# EasyEDA Pro project xu316-hardware-20260830.epro

# Schematic Schematic1

## Sheets
1 XMOS
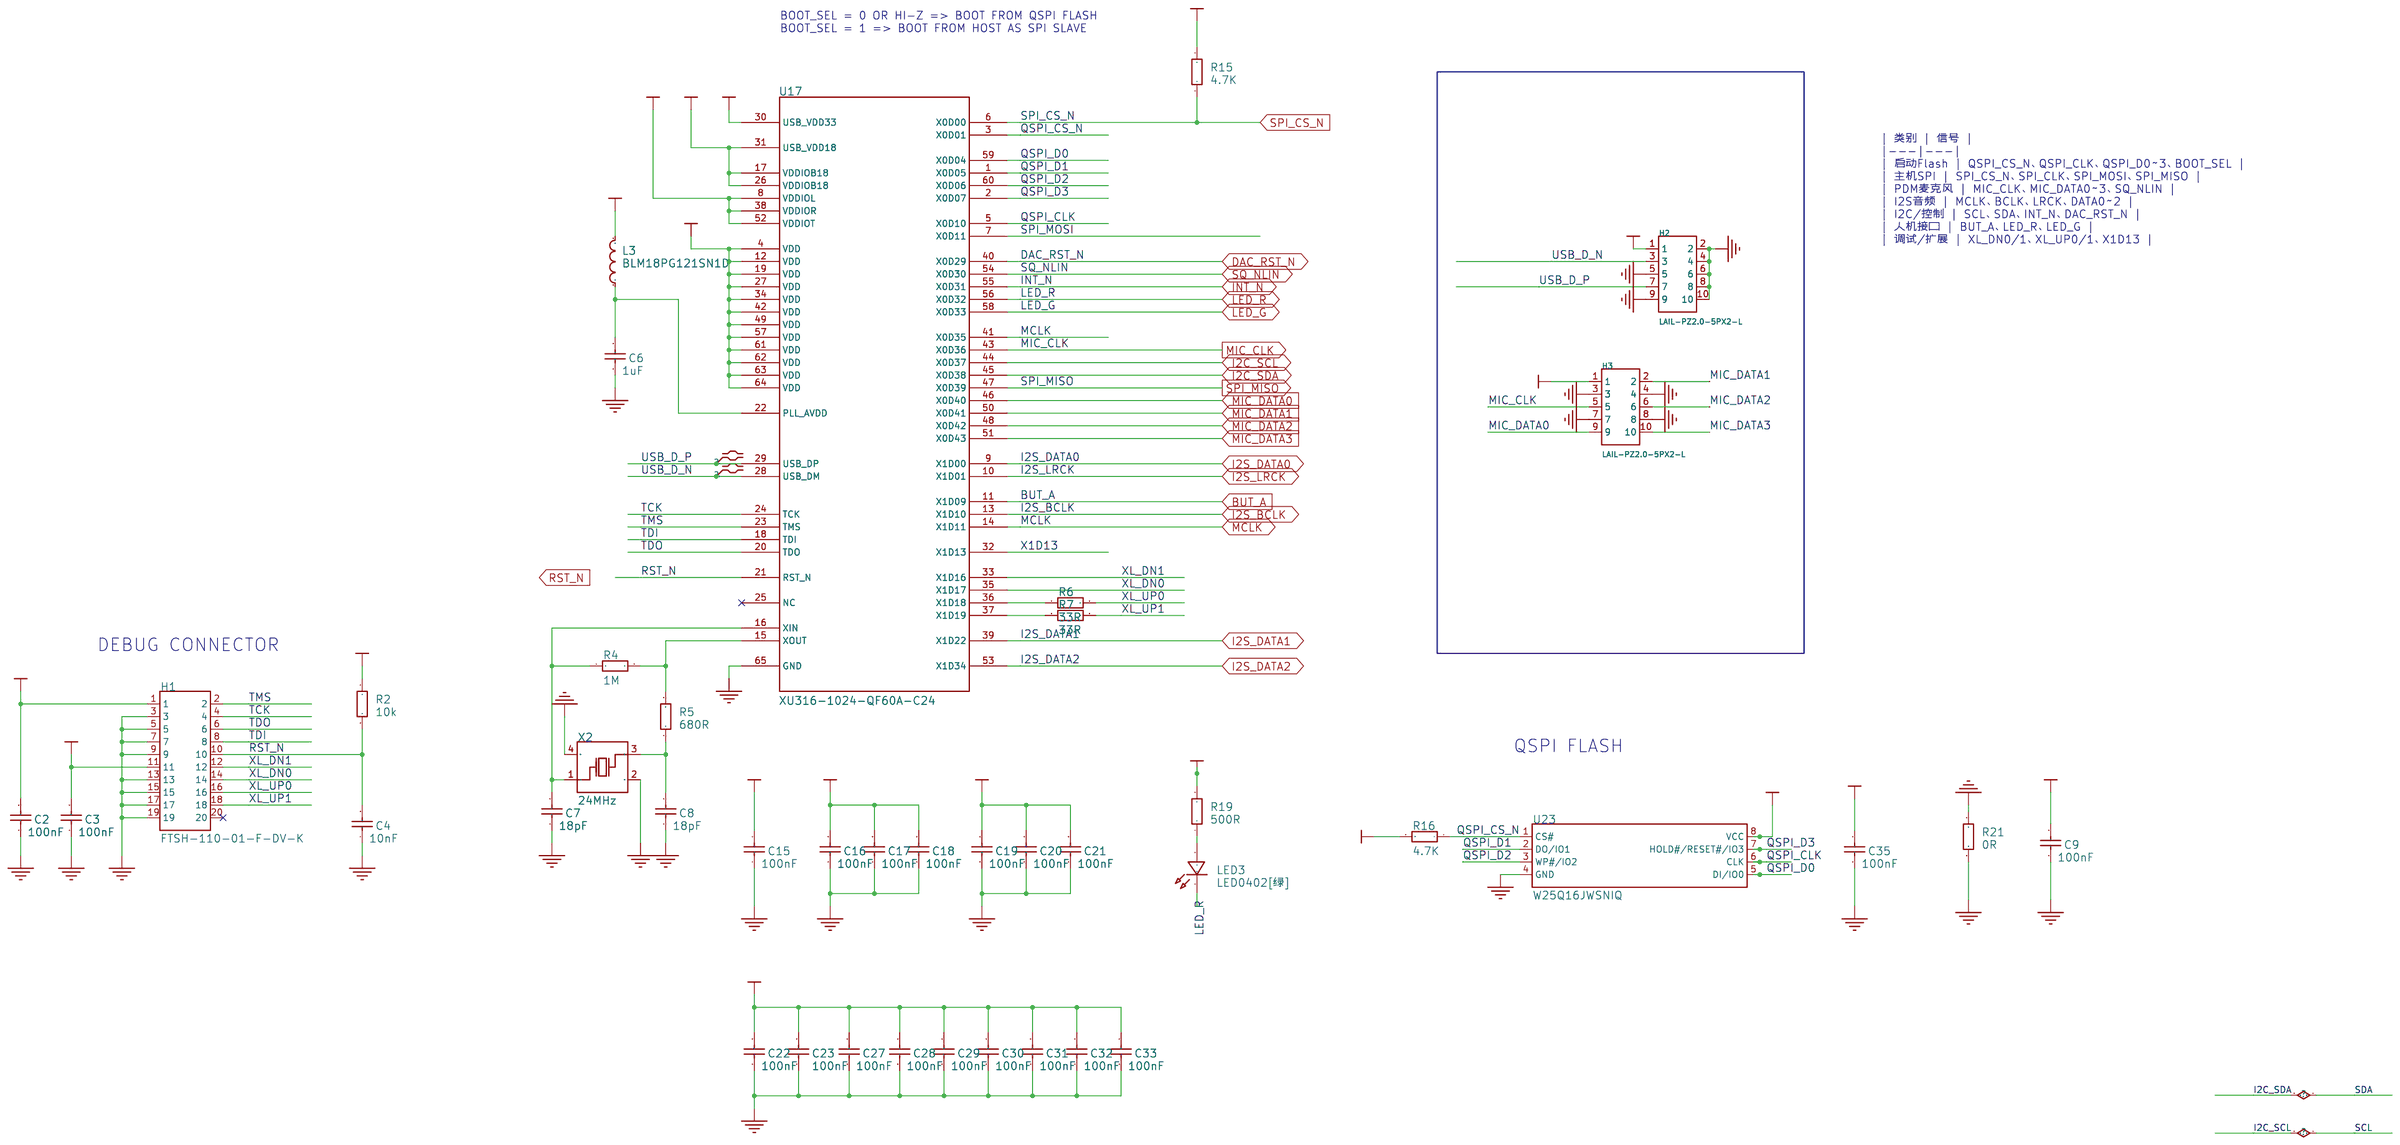
[diagram p0: XMOS]
2 Power
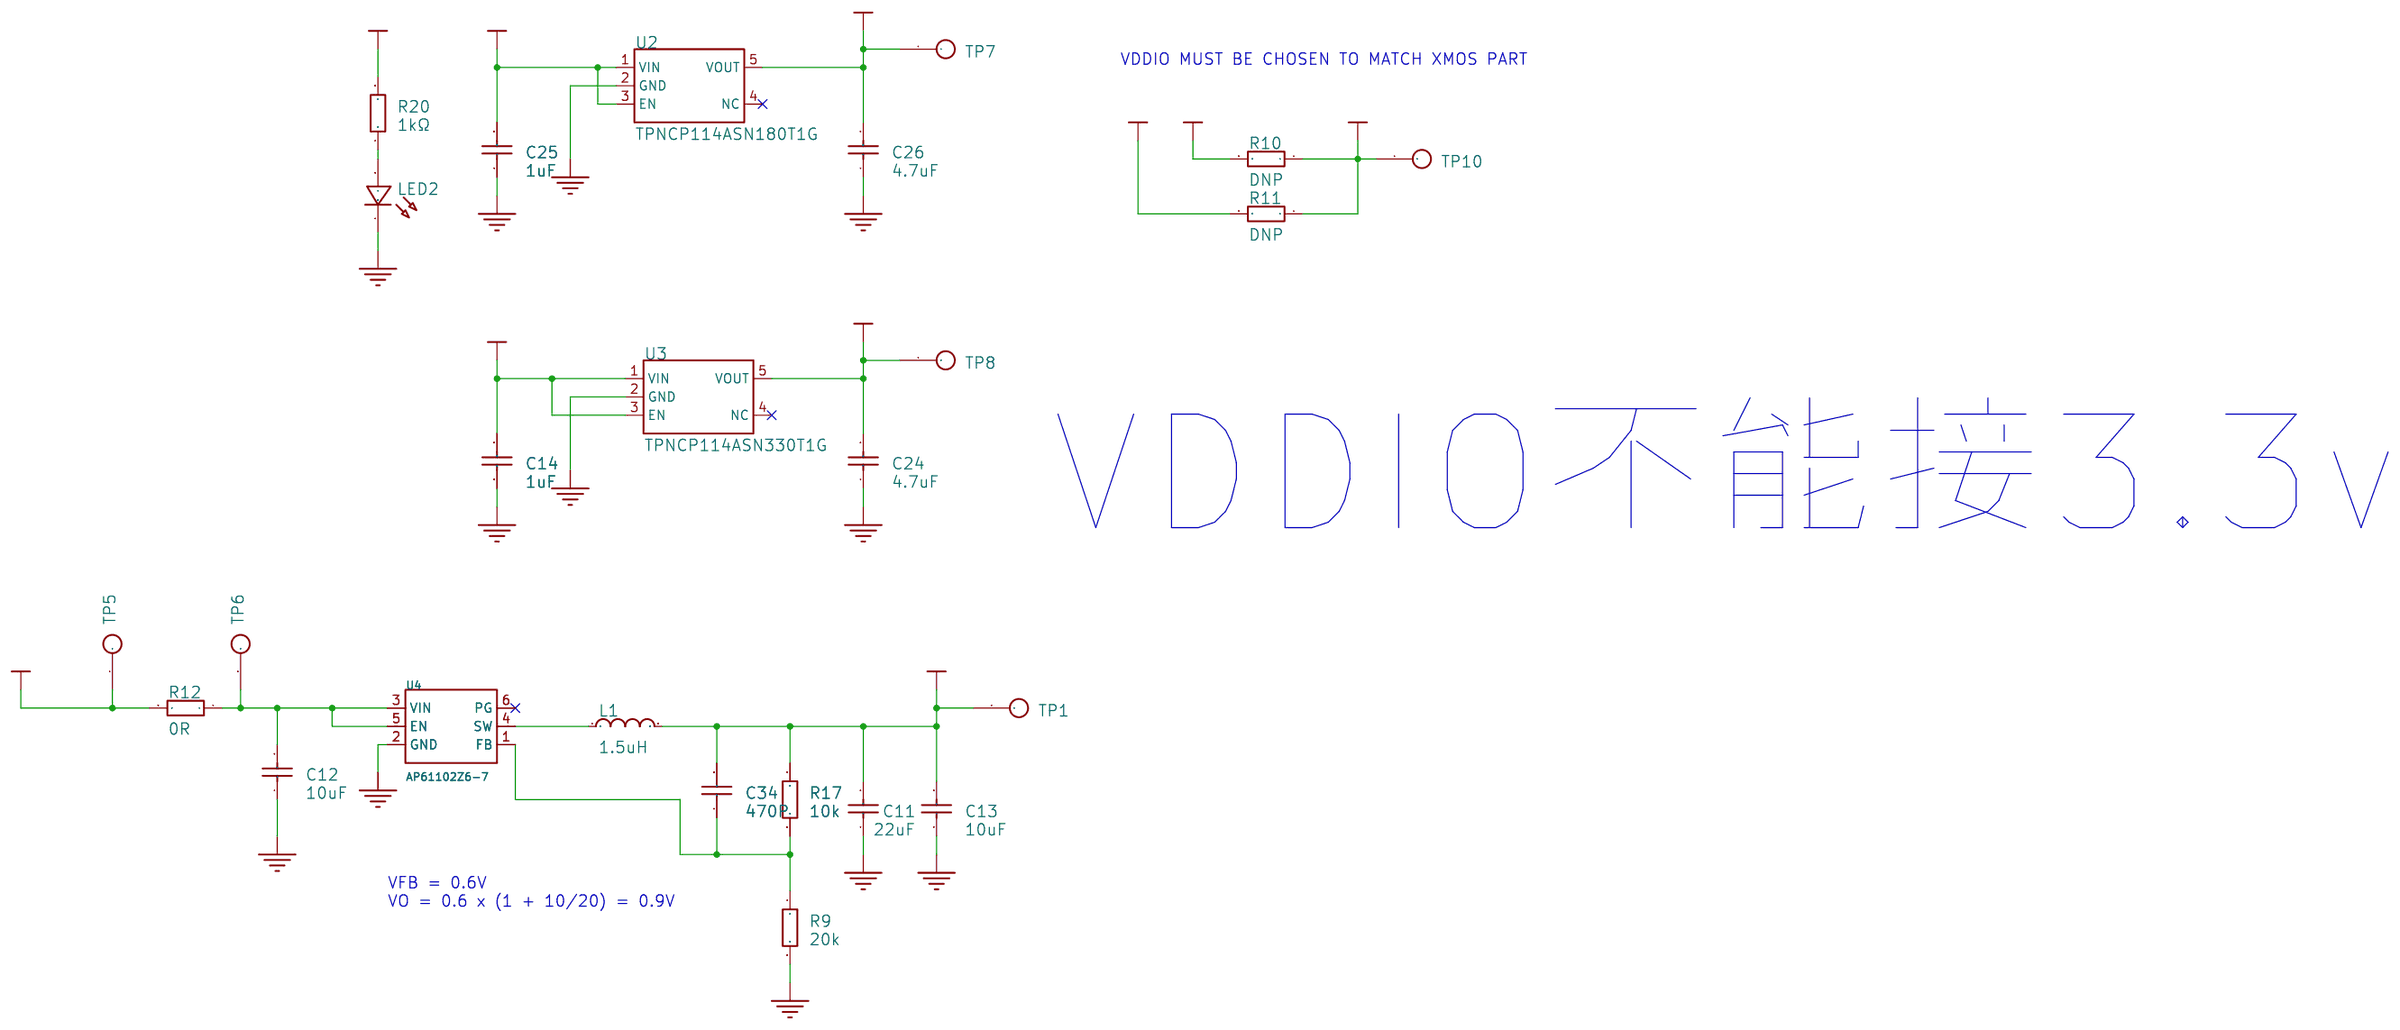
[diagram p1: Power]

## Parts
sheet Power
C11  22uF  [C0402]
C12  10uF  [C0402]
C13  10uF  [C0402]
C14  1uF  [C0402]
C24  4.7uF  [C0402]
C25  1uF  [C0402]
C26  4.7uF  [C0402]
C34  470P  [C0402]
L1  1.5uH  [IND-SMD_L4.0-W4.0_PRS4018]
LED2  -  [LED_0603]
R9  20k  [R0402]
R10  DNP  [R0402]
R11  DNP  [R0402]
R12  0R  [R0402]
R17  10k  [R0402]
R20  1kΩ  [R0402]
TP1  TESTPOINT  [TESTPOINT_SMD_0.9MM_L]
TP5  TESTPOINT  [TESTPOINT_THRU]
TP6  TESTPOINT  [TESTPOINT_THRU]
TP7  TESTPOINT  [TESTPOINT_SMD_0.9MM_L]
TP8  TESTPOINT  [TESTPOINT_SMD_0.9MM_L]
TP10  TESTPOINT  [TESTPOINT_SMD_0.9MM_L]
U2  TPNCP114ASN180T1G  [SOT-23-5_L2.9-W1.6-P0.95-LS2.8-BR]
U3  TPNCP114ASN330T1G  [SOT-23-5_L2.9-W1.6-P0.95-LS2.8-BR]
U4  AP61102Z6-7  [SOT-563-6_L1.6-W1.2-P0.50-LS1.6-BL]
sheet XMOS
?#1  DIFFPAIR
?#2  DIFFPAIR
C2  100nF  [C0402]
C3  100nF  [C0402]
C4  10nF  [C0402]
C6  1uF  [C0402]
C7  18pF  [C0402]
C8  18pF  [C0402]
C9  100nF  [C0402]
C15  100nF  [C0402]
C16  100nF  [C0402]
C17  100nF  [C0402]
C18  100nF  [C0402]
C19  100nF  [C0402]
C20  100nF  [C0402]
C21  100nF  [C0402]
C22  100nF  [C0402]
C23  100nF  [C0402]
C27  100nF  [C0402]
C28  100nF  [C0402]
C29  100nF  [C0402]
C30  100nF  [C0402]
C31  100nF  [C0402]
C32  100nF  [C0402]
C33  100nF  [C0402]
C35  100nF  [C0402]
H1  FTSH-110-01-F-DV-K  [CONN-SMD_20P-P1.27_FTSH-110-01-F-DV-K-P-TR]
H2  LAIL-PZ2.0-5PX2-L  [HDR-TH_LAIL-PZ2.0-5PX2-L]
H3  LAIL-PZ2.0-5PX2-L  [HDR-TH_LAIL-PZ2.0-5PX2-L]
L3  BLM18PG121SN1D  [L0603]
LED3  LED0402[绿]  [LED0402-R-RD_GREEN]
R2  10k  [R0402]
R4  1M  [R0402]
R5  680R  [R0402]
R6  33R  [R0402]
R7  33R  [R0402]
R15  4.7K  [R0402]
R16  4.7K  [R0402]
R19  500R  [R0402]
R21  0R  [R0402]
U17  XU316-1024-QF60A-C24  [QFN-60_L7.0-W7.0-P0.40-TL-EP3.6]
U23  W25Q16JWSNIQ  [SOP-8_L4.9-W3.9-P1.27-LS6.0-BL]
X2  24MHz  [OSC-SMD_4P-XRCGB24M000F0L00R0]

## Library data of the parts
C2-C4 C6-C9 C11-C35 = CL05A106MQ5NUNC: 容值:10uF;精度:±20%;额定电压:6.3V;温度系数:X5R;; LCSC Part Name: 10uF ±20% 6.3V; Supplier Part: C15525; Manufacturer: SAMSUNG(三星); Supplier Footprint: 0402; JLCPCB Part Class: Basic Part; Datasheet: https://item.szlcsc.com/datasheet/CL05A106MQ5NUNC/16204.html; Supplier: LCSC; Tolerance: ±20%; Voltage Rating: 6.3V; Temperature Coefficient: X5R
L1 = PSPNAQ4020-1R5M: 电感值:1.5uH;精度:±20%;额定电流:1.98A;饱和电流(Isat):4.45A;; LCSC Part Name: 1.5uH ±20% 4.45A; Supplier Part: C436656; Manufacturer: PROD(谱罗德); Supplier Footprint: SMD,4x4mm; JLCPCB Part Class: Extended Part; Datasheet: https://item.szlcsc.com/datasheet/PSPNAQ4020-1R5M/434435.html; Supplier: LCSC; Tolerance: ±20%; Current Rating: 1.98A; Current - Saturation(Isat): 4.45A; DC Resistance(DCR): 35mΩ; Ratings: AEC-Q200
LED2 = LED_0603-R: Supplier Footprint: 0603; Supplier Part: C84263
R2 R4-R7 R9-R12 R15-R17 R19-R21 = 0402WGF1001TCE: 电阻类型:厚膜电阻;阻值:1kΩ;精度:±1%;功率:62.5mW;最大工作电压:50V;温度系数:±100ppm/℃;; LCSC Part Name: 1kΩ ±1% 62.5mW 厚膜电阻; Supplier Part: C11702; Manufacturer: UNI-ROYAL(厚声); Supplier Footprint: 0402; JLCPCB Part Class: 基础库; Datasheet: https://atta.szlcsc.com/upload/public/pdf/source/20200306/C422600_1E6D84923E4A46A82E41ADD87F860B5C.pdf; Supplier: LCSC; Type: 厚膜电阻; Tolerance: ±1%; Power(Watts): 62.5mW; Overload Voltage (Max): 50V; Temperature Coefficient: ±100ppm/℃; Operating Temperature Range: -55℃~+155℃
TP1 TP7 TP8 TP10 = GEN-24-0019: Testpoint, SMD, 0.9mm; Manufacturer: NA; Manufacturer Part Number: NA; Approx Volume Cost ($): NA; LibraryName: JG_GeneralLibrary
TP5 TP6 = GEN-24-0002: Testpoint, Through Hole; Manufacturer: NA; Manufacturer Part Number: NA; Approx Volume Cost ($): NA; LibraryName: JG_GeneralLibrary
U2 = TPNCP114ASN180T1G: 输出极性:正极;工作电压:5.5V;输出电压:1.8V;输出电流:300mA;电源纹波抑制比(PSRR):-;输出类型:固定;; LCSC Part Name: 1.8V 300mA 5.5V; Supplier Part: C5350816; Manufacturer: TECH PUBLIC(台舟); Supplier Footprint: SOT-23-5; JLCPCB Part Class: Extended Part; Datasheet: https://item.szlcsc.com/datasheet/TPNCP114ASN180T1G/6138666.html; Supplier: LCSC; Output Configuration: 正极; Voltage - Supply: 5.5V; Output Voltage: 1.8V; Output Current: 300mA; Voltage Dropout: 280mV@(300mA); standby current: 25uA; Features: 过流保护；使能控制；热关断；输出放电; Operating Temperature: -40℃~+85℃@(Ta); Output Type: 固定; Number of Outputs: 1
U3 = TPNCP114ASN330T1G: 输出极性:正极;工作电压:5.5V;输出电压:3.3V;输出电流:300mA;电源纹波抑制比(PSRR):-;输出类型:固定;; LCSC Part Name: 3.3V 300mA 5.5V; Supplier Part: C5350815; Manufacturer: TECH PUBLIC(台舟); Supplier Footprint: SOT-23-5; JLCPCB Part Class: Extended Part; Datasheet: https://item.szlcsc.com/datasheet/TPNCP114ASN330T1G/6138665.html; Supplier: LCSC; Output Configuration: 正极; Voltage - Supply: 5.5V; Output Voltage: 3.3V; Output Current: 300mA; Voltage Dropout: 180mV@(300mA); standby current: 25uA; Features: 使能控制；过流保护；输出放电；热关断; Operating Temperature: -40℃~+85℃@(Ta); Output Type: 固定; Number of Outputs: 1
U4 = AP61102Z6-7_C3193199: 功能类型:降压型;工作电压:2.3V~5.5V;输出电压:600mV~3.6V;输出电流:1A;输出类型:可调;; LCSC Part Name: 降压型 1A 2.3V~5.5V; Supplier Part: C3193199; Manufacturer: DIODES(美台); Supplier Footprint: SOT-563; JLCPCB Part Class: Extended Part; Datasheet: https://item.szlcsc.com/datasheet/AP61102Z6-7/3755146.html; Supplier: LCSC; Function: 降压型; Voltage - Supply: 2.3V~5.5V; Output Voltage: 600mV~3.6V; Output Current: 1A; Frequency - Switching: 2.2MHz; Operating Temperature: -40℃~+85℃; Synchronous Rectifier: 是; Number of Outputs: 1; Topology: 降压式; Quiescent Current: 15uA; Switch tube (built-in/external): 内置; Output Type: 可调; Features: 轻载高效模式；逐波限流；过流保护；输出放电；工作状态指示；打嗝限流
?#1 ?#2 = DIFFPAIR: DifferentialPair: True; DifferentialPairClassName: USB
H1 = FTSH-110-01-F-DV-K: 插针结构:2x10P;间距:1.27mm;行距:1.27mm;圆针/方针:方针;安装方式:立贴;排数:双排;总PIN位数:20P;额定电流:3.4A;配合针长度:3.05mm;端接针长度:-;触头材质:磷青铜;触头镀层:金;工作温度:-55℃~+125℃;颜色:黑色;; LCSC Part Name: 2x10P 间距:1.27mm 方针 立贴; Supplier Part: C22143739; Manufacturer: SAMTEC; Supplier Footprint: SMD,P=1.27mm; JLCPCB Part Class: Extended Part; Datasheet: https://item.szlcsc.com/datasheet/FTSH-110-01-F-DV-K/23575155.html; Supplier: LCSC; Pin Structure: 2x10P; Pitch: 1.27mm; Row Spacing: 1.27mm; Circluar Pins/Square Pins: 方针; Mounting Type: 立贴; Number of Rows: 双排; Number of Pins: 20P; Current Rating: 3.4A; Length of Mating Pin: 3.05mm; Contact Material: 磷青铜; Contact Plating: 金; Operating Temperature: -55℃~+125℃; Color: 黑色
H2 H3 = LAIL-PZ2.0-5PX2-L: 插针结构:2x5P;间距:2mm;行距:2mm;圆针/方针:方针;排数:双排;总PIN位数:10P;额定电流:2A;额定电压:250V;塑高:2mm;端接针长度:2.8mm;触头材质:黄铜;触头镀层:金;工作温度:-25℃~+80℃;颜色:黑色;; LCSC Part Name: 2x5P 间距:2mm 方针; Supplier Part: C54950581; Manufacturer: 莱联; Supplier Footprint: 插件,P=2mm; JLCPCB Part Class: Extended Part; Datasheet: https://item.szlcsc.com/datasheet/LAIL-PZ2.0-5PX2-L/58519934.html; Supplier: LCSC; Pin Structure: 2x5P; Pitch: 2mm; Row Spacing: 2mm; Circluar Pins/Square Pins: 方针; Number of Rows: 双排; Number of Pins: 10P; Current Rating: 2A; Voltage Rating (Max): 250V; Insulation Height: 2mm; Length of End Connection Pin: 2.8mm; Contact Material: 黄铜; Contact Plating: 金; Operating Temperature: -25℃~+80℃; Color: 黑色
L3 = BLM18PG121SN1D: 阻抗@频率:120Ω@100MHz;误差:±25%;直流电阻(DCR):50mΩ;; LCSC Part Name: 单路 0603磁珠 阻抗120Ω@100MHz; Supplier Part: C14709; Manufacturer: muRata(村田); Supplier Footprint: 0603; JLCPCB Part Class: Basic Part; Datasheet: https://item.szlcsc.com/datasheet/BLM18PG121SN1D/15379.html; Supplier: LCSC; Impedance @ Frequency: 120Ω@100MHz; Tolerance: ±25%; DC Resistance(DCR): 50mΩ; Current Rating: 2A; Number of Circuits: 1; Operating Temperature: -55℃~+125℃
LED3 = LED0402[绿]: Supplier Part: C9900022545; Supplier Footprint: LED0402; JLCPCB Part Class: Extended Part; Supplier: LCSC
U17 = GEN-08-0033: Processor, xcore.ai, 7x7mm 60QFN, 1200MIPS, 1.8V VDDIO; Manufacturer: XMOS; Approx Volume Cost ($): 1; Web Search Link: http://www.google.com/search?q=XU316-1024-QF60A; LibraryName: JG_GeneralLibrary
U23 = W25Q16JWSNIQ: 接口类型:SPI;存储容量:16Mbit;时钟频率(fc):133MHz;; LCSC Part Name: 具备双路、四路SPI接口的1.8V、16Mbit 串行闪存; Supplier Part: C7117004; Manufacturer: Winbond(华邦); Supplier Footprint: SOIC-8; JLCPCB Part Class: Extended Part; Datasheet: https://item.szlcsc.com/datasheet/W25Q16JWSNIQ/8083750.html; Supplier: LCSC; Interface: SPI; Memory Size: 16Mbit; Clock Frequency: 133MHz; Voltage - Supply: 1.65V~1.95V; Standby Supply Current: 5uA; Program / Erase Cycles: 100000次; Page Programming Time (Tpp): 800us; Data Retention - TDR (Year): 20年; Operating Temperature: -40℃~+85℃; Features: 硬件写保护；绝对写保护；写使能锁存；软件写保护；上电复位
X2 = XRCGB24M000F0L00R0: 晶振类型:贴片晶振;频率:24MHz;常温频差:±100ppm;负载电容:6pF;频率稳定度:±50ppm;; LCSC Part Name: 24MHz ±100ppm 6pF; Supplier Part: C127896; Manufacturer: muRata(村田); Supplier Footprint: SMD2016-4P; JLCPCB Part Class: Extended Part; Datasheet: https://item.szlcsc.com/datasheet/XRCGB24M000F0L00R0/139179.html; Supplier: LCSC; Type: 贴片晶振; Normal temperature Frequency Tolerance: ±100ppm; Load Capacitance: 6pF; Frequency Stability: ±50ppm; Equivalent Series Resistance(ESR): 150Ω; Operating Temperature: -30℃~+85℃

## Nets
0V9: C11.2 C13.2 C22.2 C23.2 C27.2 C28.2 C29.2 C30.2 C31.2 C32.2 C33.2 C34.2 L1.2 L3.2 R17.1 TP1.1 U17.4(VDD) U17.12(VDD) U17.19(VDD) U17.27(VDD) U17.34(VDD) U17.42(VDD) U17.49(VDD) U17.57(VDD) U17.61(VDD) U17.62(VDD) U17.63(VDD) U17.64(VDD)
1V8: C2.2 C16.2 C17.2 C18.2 C26.2 H1.1 R2.1 R11.2 TP7.1 U2.5(VOUT) U17.17(VDDIOB18) U17.26(VDDIOB18) U17.31(USB_VDD18)
3V3: C15.2 C24.2 R10.2 TP8.1 U3.5(VOUT) U17.30(USB_VDD33)
5V: C14.2 C25.2 H2.1 R12.2 R20.2 TP5.1 U2.1(VIN) U2.3(EN) U3.1(VIN) U3.3(EN)
GND: C2.1 C3.1 C4.1 C6.1 C7.1 C8.1 C9.1 C11.1 C12.1 C13.1 C14.1 C15.1 C16.1 C17.1 C18.1 C19.1 C20.1 C21.1 C22.1 C23.1 C24.1 C25.1 C26.1 C27.1 C28.1 C29.1 C30.1 C31.1 C32.1 C33.1 C35.1 H1.3 H1.5 H1.7 H1.9 H1.13 H1.15 H1.17 H1.19 H2.2 H2.4 H2.5 H2.6 H2.8 H2.9 H2.10 LED2.1(C) R9.2 R21.2 U2.2(GND) U3.2(GND) U4.2(GND) U17.65(GND) U23.4(GND) X2.2(GND) X2.4(GND)
GND0: H3.3 H3.4 H3.7 H3.8 R21.1
VDDIO: C3.2 C9.2 C19.2 C20.2 C21.2 C35.2 H1.11 H3.1 R10.1 R11.1 R15.2 R16.2 R19.2 TP10.1 U17.8(VDDIOL) U17.38(VDDIOR) U17.52(VDDIOT) U23.8(VCC)
BUT_A: U17.11(X1D09)
DAC_RST_N: U17.40(X0D29)
I2C_SCL: U17.44(X0D37)
I2C_SDA: U17.45(X0D38)
I2S_BCLK: U17.13(X1D10)
I2S_DATA0: U17.9(X1D00)
I2S_DATA1: U17.39(X1D22)
I2S_DATA2: U17.53(X1D34)
I2S_LRCK: U17.10(X1D01)
INT_N: U17.55(X0D31)
LED_G: U17.58(X0D33)
LED_R: LED3.2 U17.56(X0D32)
MCLK: U17.14(X1D11) U17.41(X0D35)
MIC_CLK: H3.5 U17.43(X0D36)
MIC_DATA0: H3.9 U17.46(X0D40)
MIC_DATA1: H3.2 U17.50(X0D41)
MIC_DATA2: H3.6 U17.48(X0D42)
MIC_DATA3: H3.10 U17.51(X0D43)
QSPI_CLK: U17.5(X0D10) U23.6(CLK)
QSPI_CS_N: R16.1 U17.3(X0D01) U23.1(CS#)
QSPI_D0: U17.59(X0D04) U23.5(DI/IO0)
QSPI_D1: U17.1(X0D05) U23.2(DO/IO1)
QSPI_D2: U17.60(X0D06) U23.3(WP#/IO2)
QSPI_D3: U17.2(X0D07) U23.7(HOLD#/RESET#/IO3)
RST_N: C4.2 H1.10 R2.2 U17.21(RST_N)
SPI_CS_N: R15.1 U17.6(X0D00)
SPI_MISO: U17.47(X0D39)
SPI_MOSI: U17.7(X0D11)
SQ_NLIN: U17.54(X0D30)
TCK: H1.4 U17.24(TCK)
TDI: H1.8 U17.18(TDI)
TDO: H1.6 U17.20(TDO)
TMS: H1.2 U17.23(TMS)
USB_D_N: ?#2.0 H2.3 U17.28(USB_DM)
USB_D_P: ?#1.0 H2.7 U17.29(USB_DP)
X1D13: U17.32(X1D13)
XL_DN0: H1.14 U17.35(X1D17)
XL_DN1: H1.12 U17.33(X1D16)
XL_UP0: H1.16 R6.2
XL_UP1: H1.18 R7.2
$1N6: C6.2 L3.1 U17.22(PLL_AVDD)
$1N19: C7.2 R4.1 U17.16(XIN) X2.1(OSC1)
$1N20: R4.2 R5.2 U17.15(XOUT)
$1N110: R6.1 U17.36(X1D18)
$1N111: R7.1 U17.37(X1D19)
$1N173: C8.2 R5.1 X2.3(OSC2)
$1N180: LED3.1 R19.1
$2N13: L1.1 U4.4(SW)
$2N17: C12.2 R12.1 TP6.1 U4.3(VIN) U4.5(EN)
$2N18: C34.1 R9.1 R17.2 U4.1(FB)
$2N40: LED2.2(A) R20.1

Not connected (* = marked no-connect by the designer): H1 20*; U2 4(NC)*; U3 4(NC)*; U4 6(PG)*; U17 25(NC)*

## Notes on the sheets
sheet 1
- BOOT_SEL = 0 OR HI-Z => BOOT FROM QSPI FLASH
- BOOT_SEL = 1 => BOOT FROM HOST AS SPI SLAVE
- | 类别 | 信号 |
  |---|---|
  | 启动Flash | QSPI_CS_N、QSPI_CLK、QSPI_D0～3、BOOT_SEL |
  | 主机SPI | SPI_CS_N、SPI_CLK、SPI_MOSI、SPI_MISO |
  | PDM麦克风 | MIC_CLK、MIC_DATA0～3、SQ_NLIN |
  | I2S音频 | MCLK、BCLK、LRCK、DATA0～2 |
  | I2C/控制 | SCL、SDA、INT_N、DAC_RST_N |
  | 人机接口 | BUT_A、LED_R、LED_G |
  | 调试/扩展 | XL_DN0/1、XL_UP0/1、X1D13 |
- DEBUG CONNECTOR
- QSPI FLASH
sheet 2
- VDDIO MUST BE CHOSEN TO MATCH XMOS PART
- VDDIO不能接3.3v
- VFB = 0.6V
- VO = 0.6 x (1 + 10/20) = 0.9V

# Board PCB1
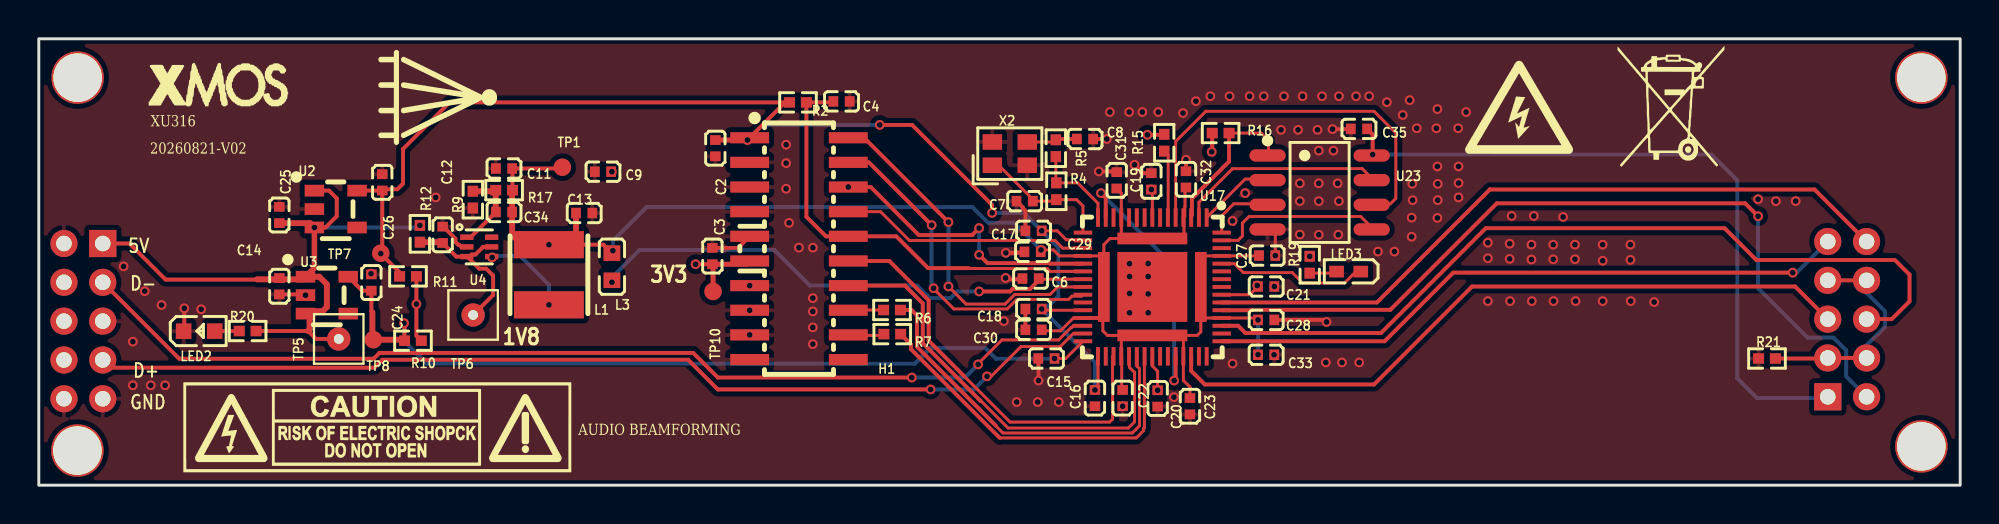
[diagram p2: board, top side]
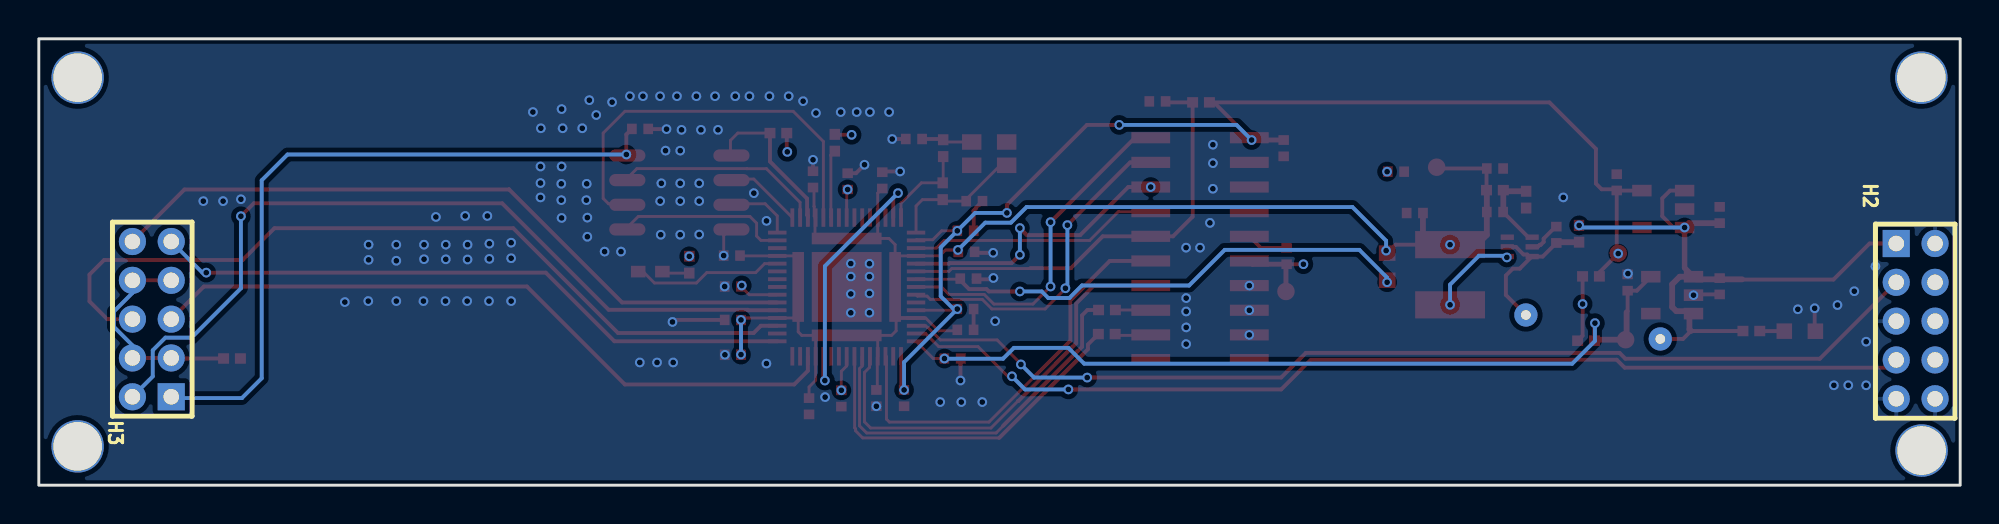
[diagram p3: board, bottom side, seen from below]

Outline 99 x 23 mm; copper layers: Top Layer, VDDIO, GND, Bottom Layer. Coordinates in mm from the lower left corner of the outline.
Outline path: rectangle 0,23 99,0
Stack: Top Layer 0.035mm Outer layer thickness 1oz / Dielectric1 0.2104mm 7628 RC49% 8.6mil / VDDIO 0.0152mm Inner layer thickness / Dielectric2 1.065mm 1.1mm H/HOZ Copper / GND 0.0152mm Inner layer thickness / Dielectric3 0.2104mm 7628 RC49% 8.6mil / Bottom Layer 0.035mm Outer layer thickness 1oz

## Design rules (mm)
net USB_D_P: USB-DP
net USB_D_N: USB-DP
spacing copperThickness1oz (default): track to track 0.102, other pairs 0.152 to 0.3
spacing copperThickness2oz: track to track 0.203, other pairs 0.152 to 0.3
track width copperThickness1oz (default): min 0.127, default 0.254, max 2.54
track width copperThickness2oz: min 0.203, default 0.254, max 2.54
differential pair differentialPair (default): width min 0.127, default 0.254, max 2.54; gap min 0.152, default 0.152
net GND uses copperRegion

## Placement (name value [footprint] x y rotation side)
C2  100nF  [C0402]  34.86 17.36 270 top
C3  100nF  [C0402]  34.71 11.81 90 top
C4  10nF  [C0402]  41.36 19.77 0 top
C6  1uF  [C0402]  51.1 10.65 180 top
C7  18pF  [C0402]  50.8 14.64 180 top
C8  18pF  [C0402]  53.91 17.84 0 top
C9  100nF  [C0402]  29.07 16.15 180 top
C11  22uF  [C0402]  23.97 16.32 180 top
C12  10uF  [C0402]  20.81 12.9 90 top
C13  10uF  [C0402]  28.1 14.02 0 top
C14  1uF  [C0402]  12.39 10.25 270 top
C15  100nF  [C0402]  51.92 6.53 180 top
C16  100nF  [C0402]  54.42 4.49 270 top
C17  100nF  [C0402]  51.25 13.11 180 top
C18  100nF  [C0402]  51.25 9.08 180 top
C19  100nF  [C0402]  57.32 15.66 90 top
C20  100nF  [C0402]  57.65 4.47 270 top
C21  100nF  [C0402]  63.24 10.24 0 top
C22  100nF  [C0402]  55.84 4.49 270 top
C23  100nF  [C0402]  59.31 4.07 270 top
C24  4.7uF  [C0402]  17.14 10.44 90 top
C25  1uF  [C0402]  12.39 13.92 90 top
C26  4.7uF  [C0402]  17.7 15.61 90 top
C27  100nF  [C0402]  63.29 11.83 0 top
C28  100nF  [C0402]  63.24 8.52 0 top
C29  100nF  [C0402]  51.2 12.02 180 top
C30  100nF  [C0402]  51.25 8.01 180 top
C31  100nF  [C0402]  55.54 15.71 90 top
C32  100nF  [C0402]  59.11 15.76 90 top
C33  100nF  [C0402]  63.24 6.72 0 top
C34  470P  [C0402]  23.97 14.08 180 top
C35  100nF  [C0402#2]  68.02 18.36 0 top
H1  FTSH-110-01-F-DV-K  [CONN-SMD_20P-P1.27_FTSH-110-01-F-DV-K-P-TR]  39.17 12.19 270 top
H2  LAIL-PZ2.0-5PX2-L  [HDR-TH_LAIL-PZ2.0-5PX2-L]  2.3 8.45 270 bottom
H3  LAIL-PZ2.0-5PX2-L  [HDR-TH_LAIL-PZ2.0-5PX2-L]  93.18 8.55 90 bottom
L1  1.5uH  [IND-SMD_L4.0-W4.0_PRS4018]  26.28 10.84 270 top
L3  BLM18PG121SN1D  [L0603]  29.53 11.26 90 top
LED2  -  [LED_0603]  8.31 7.94 0 top
LED3  LED0402[绿]  [LED0402-R-RD_GREEN]  67.49 11 180 top
NOREF  -  [Pad_e437]  97 21 0 top
NOREF#2  -  [Pad_e436]  97 2 0 top
NOREF#3  -  [Pad_e435]  1.99 1.78 0 top
NOREF#4  -  [Pad_e434]  2 21 0 top
R2  10k  [R0402]  39.12 19.72 180 top
R4  1M  [R0402]  52.43 15.15 270 top
R5  680R  [R0402]  52.4 17.36 90 top
R6  33R  [R0402]  43.96 9.03 0 top
R7  33R  [R0402]  43.97 7.78 0 top
R9  20k  [R0402]  22.36 14.71 90 top
R10  DNP  [R0402]  19.28 7.44 0 top
R11  DNP  [R0402]  19.02 10.76 0 top
R12  0R  [R0402]  19.64 12.95 270 top
R15  4.7K  [R0402]  57.99 17.64 270 top
R16  4.7K  [R0402]  60.89 18.14 0 top
R17  10k  [R0402]  23.97 15.2 0 top
R19  500R  [R0402#2]  65.48 11.36 90 top
R20  1kΩ  [R0402#2]  10.76 7.94 0 top
R21  0R  [R0402#2]  89.05 6.53 180 top
TP1  TESTPOINT  [TESTPOINT_SMD_0.9MM_L]  26.97 16.38 0 top
TP5  TESTPOINT  [TESTPOINT_THRU]  15.45 7.53 0 top
TP6  TESTPOINT  [TESTPOINT_THRU]  22.38 8.77 0 top
TP7  TESTPOINT  [TESTPOINT_SMD_0.9MM_L]  17.62 11.95 0 top
TP8  TESTPOINT  [TESTPOINT_SMD_0.9MM_L]  17.24 7.5 0 top
TP10  TESTPOINT  [TESTPOINT_SMD_0.9MM_L]  34.74 9.98 180 top
U2  TPNCP114ASN180T1G  [SOT-23-5_L2.9-W1.6-P0.95-LS2.8-BR]  15.3 14.23 0 top
U3  TPNCP114ASN330T1G  [SOT-23-5_L2.9-W1.6-P0.95-LS2.8-BR]  14.84 9.79 0 top
U4  AP61102Z6-7  [SOT-563-6_L1.6-W1.2-P0.50-LS1.6-BL]  22.7 12.28 270 top
U17  XU316-1024-QF60A-C24  [QFN-60_L7.0-W7.0-P0.40-TL-EP3.6]  57.38 10.21 270 top
U23  W25Q16JWSNIQ  [SOP-8_L4.9-W3.9-P1.27-LS6.0-BL]  65.99 15.08 270 top
X2  24MHz  [OSC-SMD_4P-XRCGB24M000F0L00R0]  50.03 17.08 0 top

## Footprints (pads in the part's own frame, mm; a bottom-side part is the same pattern mirrored in y, then rotated)
C0402
  rect 0.5x0.54 smd: 1(0.42,0) 2(-0.42,0)
C0402#2
  rect 0.5x0.54 smd: 1(-0.42,0) 2(0.42,0)
CONN-SMD_20P-P1.27_FTSH-110-01-F-DV-K-P-TR
  rect 0.574x2 smd: 1(-5.715,-2.54) 2(-5.715,2.54) 3(-4.445,-2.54) 4(-4.445,2.54) 5(-3.175,-2.54) 6(-3.175,2.54) 7(-1.905,-2.54) 8(-1.905,2.54) 9(-0.635,-2.54) 10(-0.635,2.54) 11(0.635,-2.54) 12(0.635,2.54) 13(1.905,-2.54) 14(1.905,2.54) 15(3.175,-2.54) 16(3.175,2.54) 17(4.445,-2.54) 18(4.445,2.54) 19(5.715,-2.54) 20(5.715,2.54)
HDR-TH_LAIL-PZ2.0-5PX2-L
  rect 1.4x1.4 hole 0.8: 1(-4,-1)
  round 1.4 hole 0.8: 2(-4,1) 3(-2,-1) 4(-2,1) 5(0,-1) 6(0,1) 7(2,-1) 8(2,1) 9(4,-1) 10(4,1)
IND-SMD_L4.0-W4.0_PRS4018
  rect 1.4x3.6 smd: 1(1.55,0) 2(-1.55,0)
L0603
  rect 0.8x0.864 smd: 1(-0.7,0) 2(0.7,0)
LED0402-R-RD_GREEN
  rect 0.75x0.6 smd: 1(0.623,0) 2(-0.623,0)
LED_0603
  rect 0.8x0.8 smd: 1(-0.851,-0.01) 2(0.75,-0.005)
OSC-SMD_4P-XRCGB24M000F0L00R0
  rect 1x0.8 smd: 1(-0.9,-0.6) 2(0.9,-0.6) 3(0.9,0.6) 4(-0.9,0.6)
Pad_e434
  round 2.7 hole 2.5: 1(0,0)
Pad_e435
  round 2.7 hole 2.5: 1(0,0)
Pad_e436
  round 2.7 hole 2.5: 1(0,0)
Pad_e437
  round 2.7 hole 2.5: 1(0,0)
QFN-60_L7.0-W7.0-P0.40-TL-EP3.6
  rect 0.95x0.2 smd: 1(-3.575,2.8) 2(-3.575,2.4) 3(-3.575,2) 4(-3.575,1.6) 5(-3.575,1.2) 6(-3.575,0.8) 7(-3.575,0.4) 8(-3.575,0) 9(-3.575,-0.4) 10(-3.575,-0.8) 11(-3.575,-1.2) 12(-3.575,-1.6) 13(-3.575,-2) 14(-3.575,-2.4) 15(-3.575,-2.8) 31(3.575,-2.8) 32(3.575,-2.4) 33(3.575,-2.001) 34(3.575,-1.6) 35(3.575,-1.2) 36(3.575,-0.8) 37(3.575,-0.4) 38(3.575,-0.001) 39(3.575,0.4) 40(3.575,0.8) 41(3.575,1.2) 42(3.575,1.6) 43(3.575,2) 44(3.575,2.4) 45(3.575,2.8)
  rect 0.2x0.95 smd: 16(-2.8,-3.575) 17(-2.4,-3.575) 18(-2,-3.575) 19(-1.6,-3.575) 20(-1.2,-3.575) 21(-0.8,-3.575) 22(-0.4,-3.575) 23(0,-3.575) 24(0.4,-3.575) 25(0.8,-3.575) 26(1.2,-3.575) 27(1.6,-3.575) 28(2,-3.575) 29(2.4,-3.575) 30(2.8,-3.575) 46(2.8,3.575) 47(2.4,3.575) 48(2,3.575) 49(1.6,3.575) 50(1.2,3.575) 51(0.8,3.575) 52(0.4,3.575) 53(0,3.575) 54(-0.4,3.575) 55(-0.8,3.575) 56(-1.2,3.575) 57(-1.6,3.575) 58(-2,3.575) 59(-2.4,3.575) 60(-2.8,3.575)
  rect 0.6x3.6 smd: 61(2.497,0) 63(-2.497,0)
  rect 3.6x0.6 smd: 62(0,-2.497) 64(0,2.497)
  rect 3.6x3.6 smd: 65(0,0)
R0402
  rect 0.566x0.54 smd: 1(0.433,0) 2(-0.433,0)
R0402#2
  rect 0.566x0.54 smd: 1(-0.433,0) 2(0.433,0)
SOP-8_L4.9-W3.9-P1.27-LS6.0-BL
  oval 0.63x1.865 smd: 1(-1.905,-2.683) 2(-0.635,-2.683) 3(0.635,-2.683) 4(1.905,-2.683) 5(1.905,2.683) 6(0.635,2.683) 7(-0.635,2.683) 8(-1.905,2.683)
SOT-23-5_L2.9-W1.6-P0.95-LS2.8-BR
  rect 1x0.6 smd: 1(-1.1,0.95) 2(-1.1,0) 3(-1.1,-0.95) 4(1.1,-0.95) 5(1.1,0.95)
SOT-563-6_L1.6-W1.2-P0.50-LS1.6-BL
  rect 0.28x0.68 smd: 1(-0.5,-0.64) 2(0,-0.64) 3(0.5,-0.64) 4(0.5,0.64) 5(0,0.64) 6(-0.5,0.64)
TESTPOINT_SMD_0.9MM_L
  round 0.9 smd: 1(0,0)
TESTPOINT_THRU
  round 1.2 hole 0.5: 1(0,0)

## Nets
As in the schematic.

Pads without a net: H1 20; NOREF 1; NOREF#2 1; NOREF#3 1; NOREF#4 1; U2 4; U3 4; U4 6; U17 25

## Via types
v1: diameter 0.5, hole 0.3, Top Layer to Bottom Layer, 181 vias

## Routing (per net, layer and track width the routed paths; a pad name or vN(x,y) marks a point on that pad's centre or on a via; arc(x,y) is an arc through that point)
0V9: length 81.2
  Top Layer w0.15: 59.93,11.81 U17.57 62.85,11.81 C27.2 ; 59.87,8.72 U17.64 ; 59.87,8.72 59.87,7.9 59.69,7.72 57.9,7.72 57.97,7.65 58.97,7.65 U17.42 58.97,5.4 59.31,5.06 C23.2 ; 59.87,8.72 59.98,8.61 U17.49 62.72,8.61 v1(62.82,8.52) ; C31.2 55.78,15.05 U17.12 55.78,12.87 55.93,12.71 55.2,12.71 54.88,12.39 54.88,10.74 54.82,10.79 54.82,11.81 U17.19 52.59,11.81 52.28,12.12 v1(51.64,12.12) ; C22.2 55.8,4.96 55.8,6.57 ; U17.63 57.44,12.65 59.01,12.65 59.01,13.76 U17.4 59.05,13.86 59.05,14.36 59.06,14.37 59.06,15.34 ; C30.2 51.73,7.95 52.64,7.95 53.3,8.61 U17.27 ; 54.82,9.64 54.82,7.95 55.06,7.72 56.85,7.72 56.7,7.57 55.81,7.57 55.78,7.53 U17.34
  Top Layer w0.2: U17.62 54.88,9.69 54.82,9.64 54.98,9.49 54.98,8.61 U17.27 ; 27.28,12.39 29.09,12.39 L3.2 ; 26.87,16.33 26.86,16.32 C11.2 24.41,16.3 24.41,15.2
  Top Layer w0.3: 24.41,15.2 24.39,15.19 C34.2 24.39,12.89 24.89,12.39 v1(26.28,12.39) 27.28,12.39 27.68,12.79 C13.2
  Bottom Layer w0.2: v1(62.82,8.52) v1(62.82,6.73) ; v1(51.64,12.12) 50.23,13.53 48.91,13.53 48.11,14.33 31.31,14.33 29.58,12.6 v1(29.58,12.09)
1V8: length 68.9
  Top Layer w0.15: v1(51.68,9.08) 51.74,9.01 U17.26 ; U17.17 53.77,12.65 52.94,12.65 52.48,13.11 v1(51.68,13.11) ; U17.31 54.57,5.06 v1(54.42,4.91)
  Top Layer w0.2: v1(17.62,11.93) 18.59,10.96 R11.2 ; C26.2 17.69,15.18 U2.5 ; C26.2 17.76,15.25 18.47,15.25 18.77,15.54 18.77,17.33 21.17,19.72 38.45,19.72 ; C26.2 17.7,12.03 TP7.1 ; v1(43.33,18.56) 45,18.56 49.12,14.44 v1(49.12,14.03) ; 36.6,17.88 38.45,19.72 ; 38.45,19.72 R2.1
  Top Layer w0.254: C2.2 v1(36.51,17.78) 36.6,17.88
  Top Layer w0.3: 17.62,11.95 v1(17.62,11.93)
  Bottom Layer w0.2: v1(49.12,14.03) 50.75,14.03 v1(51.68,13.11) 52.53,12.25 52.53,9.74 51.87,9.08 v1(51.68,9.08) 54.42,6.33 v1(54.42,4.91) ; v1(36.51,17.78) 37.29,18.56 v1(43.33,18.56)
3V3: length 43.9
  Top Layer w0.15: v1(52.34,6.53) 52.91,6.53 U17.30
  Top Layer w0.2: v1(18.82,8.35) 18.84,8.33 R10.2 ; 17.19,8.91 17.14,8.96 C24.2 16.66,10.02 15.94,10.74
  Top Layer w0.3: R10.2 18.79,7.5 TP8.1 17.19,7.55 17.19,8.91
  Bottom Layer w0.2: v1(18.82,8.35) 18.82,7.43 19.99,6.26 45.13,6.26 45.95,7.08 48.76,7.08 49.32,6.52 52.33,6.52 v1(52.34,6.53)
5V: length 34.1
  Top Layer w0.2: 13.87,7.95 14.28,7.53 TP5.1 ; 11.24,10.61 11.23,10.59 6.53,10.59 4.67,12.45 H2.1 ; R20.2 13.87,7.94 ; v1(14.2,13.28) 14.77,13.28 15.35,13.86 15.35,14.78 14.95,15.18 U2.1
  Top Layer w0.28: v1(14.2,13.28) 14.2,11.2 U3.1
  Top Layer w0.3: 13.61,10.61 11.24,10.61 ; 13.87,8.97 13.95,8.89 13.95,8.02 13.87,7.95 ; 13.87,8.97 14.63,8.97 14.84,9.18 14.84,10.35 14.45,10.74 U3.1 ; 13.87,8.97 13.87,8.97 U3.3 ; v1(14.2,13.28) 13.98,13.5 12.29,13.5
  Bottom Layer w0.2: v1(19.64,13.39) 19.53,13.28 v1(14.2,13.28)
GND: length 21
  Top Layer w0.15: v1(63.71,11.83) 63.71,12.88 63.36,13.23
  Top Layer w0.2: C17.1 50.84,14.14 50.71,14.26 50.71,14.3 C7.1 ; 34.71,12.23 36.03,12.23 H1.9 ; v1(49.83,11.97) 50.8,11.97 50.84,11.93 ; v1(51.51,5.39) 51.51,6.52 C15.1 ; v1(56.46,16.51) 56.89,16.08 C19.1 ; C31.1 55.5,16.17 v1(54.62,16.17) ; v1(49.81,10.68) 49.88,10.61 50.84,10.61 ; C18.1 C30.1 ; U4.2 21.77,12.28 21.66,12.39 21.61,12.39 21.46,12.53 21.46,12.7 20.84,13.32 C12.1 ; v1(13.74,9.79) 13.7,9.83 C14.1 ; C32.1 v1(59.11,16.77) ; LED2.1 7.5,7.97 v1(7.5,9.12) ; v1(66.66,18.35) 67.59,18.35 C35.1 ; v1(55.03,17.84) C8.1 ; C28.1 66.25,8.52 v1(66.35,8.41)
  vias: v1(4.37,11.27) v1(4.84,7.39) v1(4.84,5.15) v1(5.46,10) v1(5.77,5.15) v1(6.32,9.28) v1(6.51,5.15) v1(8.36,9.06) v1(17.12,10.9) v1(20.45,14.83) v1(36.63,10.28) v1(36.63,9.01) v1(36.63,7.74) v1(38.5,17.54) v1(38.5,16.59) v1(38.5,15.27) v1(38.66,13.52) v1(39.17,12.24) v1(39.89,12.24) v1(39.88,9.64) v1(39.88,8.95) v1(39.88,8.13) v1(39.88,7.27) v1(49.72,8.45) v1(50.39,4.28) v1(51.47,4.28) v1(52.56,4.28) v1(55.19,19.23) v1(55.84,4.07) v1(56.18,19.23) v1(56.2,11.41) v1(56.2,10.75) v1(56.2,9.88) v1(56.2,8.88) v1(56.86,19.23) v1(57.16,11.42) v1(57.16,10.75) v1(57.16,9.85) v1(57.16,8.88) v1(57.68,19.23) v1(58.49,4.54) v1(58.96,19.18) v1(59.62,19.79) v1(60.36,20.04) v1(61.35,20.04) v1(61.51,13.62) v1(61.51,6.27) v1(62.16,15.05) v1(62.39,20.04) v1(63.12,20.04) v1(63.66,10.24) v1(63.65,6.72) v1(64,18.31) v1(64.16,20.04) v1(64.88,18.31) v1(64.97,15.55) v1(64.97,14.64) v1(64.97,12.92) v1(65.12,20.04) v1(65.88,18.31) v1(65.95,17.24) v1(65.95,15.55) v1(65.95,14.64) v1(65.95,12.91) v1(66.12,20.04) v1(66.31,6.32) v1(66.71,17.24) v1(66.99,20.04) v1(66.93,15.55) v1(66.99,14.64) v1(66.96,12.91) v1(67.15,6.32) v1(67.87,20.04) v1(68.03,6.32) v1(68.54,20.04) v1(69,12.04) v1(69.46,19.74) v1(69.85,12.04) v1(70.28,19.07) v1(70.63,19.84) v1(70.77,15.53) v1(70.79,14.69) v1(70.74,13.79) v1(70.74,12.8) v1(71,18.39) v1(72.01,18.39) v1(72.06,19.38) v1(72.06,16.42) v1(72.08,15.53) v1(72.08,14.69) v1(72.06,13.77) v1(73.13,18.39) v1(73.15,16.42) v1(73.15,15.57) v1(73.15,14.83) v1(73.54,19.23) v1(74.66,12.49) v1(74.66,11.69) v1(74.66,9.49) v1(75.79,12.44) v1(75.79,11.66) v1(75.8,9.49) v1(75.89,13.87) v1(76.91,12.39) v1(76.91,11.63) v1(76.93,9.49) v1(77.03,13.87) v1(78.03,12.39) v1(78.03,11.64) v1(78.05,9.49) v1(78.54,13.82) v1(79.15,12.39) v1(79.15,11.64) v1(79.18,9.49) v1(80.58,12.39) v1(80.58,11.56) v1(80.58,9.49) v1(82.01,12.39) v1(82.01,11.61) v1(82.03,9.49) v1(83.23,9.44) v1(88.59,14.73) v1(89.5,14.64) v1(90.53,14.64)
GND0: length 11.5
  Top Layer w0.2: R21.1 92.15,6.53 H3.3 H3.4 ; H3.7 H3.8
  Bottom Layer w0.2: H3.8 94.18,9.9 95.13,8.95 95.13,8.16 94.18,7.21 H3.4
VDDIO: length 51
  Top Layer w0.15: U17.38 57.37,6.14 57.65,5.87 v1(57.65,4.89) ; U17.8 57.37,15.19 v1(57.32,15.24) ; U17.52 62.4,9.81 C21.2
  Top Layer w0.2: v1(60.44,17.17) 60.46,17.2 R16.2 ; v1(68.73,17.04) 68.73,18.07 C35.2 ; 19.71,7.44 19.46,7.7 v1(19.46,9.33) R11.1 ; R15.2 57.96,18.05 v1(57.12,18.05) ; v1(33.84,11.39) C3.2
  Top Layer w0.254: 36.6,11.53 36.46,11.39 C3.2 34.74,11.35 TP10.1
  Bottom Layer w0.2: H3.1 92.11,4.49 88.54,4.49 87.52,5.51 87.52,15.71 86.19,17.04 v1(68.73,17.04)
  vias: v1(29.53,16.15) v1(62.78,10.29) v1(65.48,11.79)
LED_R: length 7.8
  Top Layer w0.15: LED3.2 68.06,10.95 67.81,10.95 67.28,10.42 65.12,10.42 64.59,10.95 62.07,10.95 61.6,11.41 U17.56
MCLK: length 13.9
  Top Layer w0.2: v1(58.5,5.39) 58.57,5.47 U17.41 ; v1(54.73,15.05) 54.97,14.8 U17.14
  Bottom Layer w0.2: v1(54.73,15.05) 58.5,11.28 v1(58.5,5.39)
MIC_CLK: length 36.6
  Top Layer w0.2: U17.43 59.37,5.89 60.08,5.19 68.8,5.19 73.85,10.24 90.49,10.24 H3.5
MIC_DATA0: length 33.4
  Top Layer w0.2: v1(90.37,10.95) 72.88,10.95 69.34,7.41 U17.46
  Bottom Layer w0.2: v1(90.37,10.95) 90.57,10.95 H3.9
MIC_DATA1: length 42.6
  Top Layer w0.2: v1(88.59,13.86) 87.92,14.52 75.12,14.52 69.64,9.04 62.47,9.04 62.44,9.01 U17.50
  Bottom Layer w0.2: H3.2 93.13,5.6 93.13,6.95 92.48,7.6 91.13,7.6 88.59,10.14 v1(88.59,13.86)
MIC_DATA2: length 42.8
  Top Layer w0.2: U17.48 61.8,8.21 62.17,7.84 69.16,7.84 74.56,13.24 86.86,13.24 88.5,11.6 95.64,11.6 96.39,10.85 96.39,9.47 95.47,8.55 H3.6
MIC_DATA3: length 36.8
  Top Layer w0.2: 74.77,15.24 68.94,9.41 U17.51 ; 74.77,15.24 91.5,15.24 H3.10 ; 74.77,15.24 74.77,15.24
QSPI_CLK: length 21.1
  Top Layer w0.15: U17.5 58.57,17.71 60.13,19.27 68.8,19.27 69.92,18.14 69.92,14.78 69.64,14.5 68.73,14.5
QSPI_CS_N: length 8.1
  Top Layer w0.15: 63.36,17.04 63.36,17.77 62.99,18.14 R16.1
  Top Layer w0.2: U17.3 59.37,13.89 59.41,13.93 59.41,14.77 61.33,16.68 R16.1
QSPI_D0: length 8.9
  Top Layer w0.15: 68.73,13.23 68.11,13.84 62.36,13.84 62.02,13.5 62.02,12.84 61.79,12.61 U17.59
QSPI_D1: length 4
  Top Layer w0.15: 63.36,15.77 63.36,15.77 62.16,15.77 U17.1
QSPI_D2: length 3.5
  Top Layer w0.15: 63.36,14.5 61.57,14.5 60.95,13.88 U17.60
QSPI_D3: length 10.7
  Top Layer w0.15: U17.2 59.78,14.58 61.51,16.31 62.52,16.31 62.52,16.31 68.19,16.31 68.73,15.77
RST_N: length 22.7
  Top Layer w0.15: 47.91,11.18 47.93,11.16 51.96,11.16 52.11,11.01 U17.21
  Top Layer w0.2: C4.2 40.89,19.72 R2.2 39.55,13.83 40.56,12.82 H1.10 44.18,12.82 45.82,11.18 47.91,11.18
SPI_CS_N: length 3.5
  Top Layer w0.15: R15.1 58.19,17.01 58.19,13.81 U17.6
TCK: length 17.4
  Top Layer w0.15: U17.24 53.73,9.74 53.23,9.74 53.06,9.57 50.39,9.57 49.89,9.08 47.15,9.08 46.26,9.97 46.26,9.99 v1(46.1,10.15)
  Top Layer w0.2: H1.4 42.77,16.63 v1(46,13.4)
  Bottom Layer w0.2: v1(46,13.4) 46,10.25 v1(46.1,10.15)
TDI: length 12.9
  Top Layer w0.15: H1.8 43.37,14.09 44.85,12.61 52.36,12.61 52.76,12.21 U17.18
TDO: length 14.8
  Top Layer w0.2: U17.20 52.1,11.41 52.07,11.44 48.88,11.44 v1(48.45,11.87) ; v1(41.71,15.36) 42.87,15.36 45.34,12.89 48.09,12.89 v1(48.45,13.25)
  Bottom Layer w0.2: v1(48.45,13.25) v1(48.45,11.87)
TMS: length 17.9
  Top Layer w0.15: v1(46.87,10.24) 47.78,9.33 49.79,9.33 50.28,9.83 52.11,9.83 52.49,10.21 U17.23
  Top Layer w0.2: H1.2 42.52,17.9 v1(46.87,13.55)
  Bottom Layer w0.2: v1(46.87,13.55) v1(46.87,10.24)
USB_D_N: length 53.9
  Top Layer w0.15: U17.28 53.3,8.21 53.21,8.12 53.18,8.12 52.55,7.48 49.62,7.48 48.4,6.26 v1(48.4,6.22)
  Top Layer w0.2: H2.3 7.23,6.52 17.25,6.52 17.55,6.82 33.72,6.82 34.99,5.55 v1(44.98,5.55)
  Bottom Layer w0.2: v1(48.4,6.22) 47.72,5.55 v1(44.98,5.55)
USB_D_P: length 52.7
  Top Layer w0.15: v1(48.86,5.61) 49.07,5.61 50.6,7.14 52.63,7.14 53.3,7.81 U17.29
  Top Layer w0.2: v1(45.95,4.93) 34.99,4.93 33.46,6.46 17.7,6.46 17.29,6.06 3.69,6.06 H2.7
  Bottom Layer w0.2: v1(45.95,4.93) 48.18,4.93 v1(48.86,5.61)
XL_DN0: length 22.5
  Top Layer w0.15: 56.2,6.57 56.2,6.07 56.46,5.81 56.46,3.26 56.14,2.94 49.94,2.94 48.54,4.34
  Top Layer w0.2: 48.54,4.34 48.53,4.34 45.55,7.32 45.55,9.37 44.63,10.28 H1.14
XL_DN1: length 21.6
  Top Layer w0.15: 55.32,6.64 55.32,3.4 55.17,3.25 50.04,3.25 47.68,5.61
  Top Layer w0.2: 47.68,5.61 45.85,7.44 45.85,9.52 43.82,11.55 H1.12
XL_UP0: length 1.8
  Top Layer w0.15: R6.2 41.72,9.03 H1.16
XL_UP1: length 1.9
  Top Layer w0.15: 43.54,7.78 43.47,7.72 41.68,7.72
$1N6: length 26.5
  Top Layer w0.15: U17.22 51.68,10.61
  Top Layer w0.2: 51.68,10.61 51.57,10.61 51.07,10.1 50.17,10.1 50.05,9.98 v1(48.45,9.98)
  Bottom Layer w0.2: v1(48.45,9.98) 47.32,9.98 46.99,9.65 45.9,9.65 45.25,10.29 39.73,10.29 37.89,12.12 30.96,12.12 29.53,10.7 v1(29.53,10.46)
$1N19: length 7
  Top Layer w0.15: 49.13,16.48 49.46,16.48 51.22,14.73 C7.2 52.35,14.64 R4.1 53.47,14.71 53.8,14.39 U17.16
$1N20: length 4.7
  Top Layer w0.15: R5.2 52.4,15.61 R4.2 53.53,15.58 54.57,14.53 U17.15
$1N110: length 19.7
  Top Layer w0.15: U17.36 56.57,6.14 56.71,6.01 56.71,3.06 56.34,2.69 49.67,2.69 49.32,3.05
  Top Layer w0.2: 49.32,3.06 45.25,7.13 45.25,8.75 44.97,9.03 R6.1
$1N111: length 18.9
  Top Layer w0.15: 49.51,2.44 56.55,2.44 56.92,2.8 56.92,2.91 56.96,2.95 56.96,6.63 U17.37
  Top Layer w0.2: R7.1 44.94,7.25 44.94,7.01 49.51,2.44
$1N173: length 2.6
  Top Layer w0.15: R5.1 52.29,17.68 X2.3
  Top Layer w0.2: R5.1 52.44,17.84 53.49,17.84
$1N180: length 1.4
  Top Layer w0.15: R19.1 66.79,10.93 LED3.1
$2N13: length 4.6
  Bottom Layer w0.2: v1(26.28,9.29) 26.28,10.33 24.8,11.82 23.44,11.82 v1(23.36,11.74)
$2N17: length 8.4
  Top Layer w0.2: U4.5 22.89,12.28 22.5,11.89 22.31,11.89 22.2,11.78 22.07,11.78 ; 22.07,11.78 22.7,11.16 23.05,11.16 23.41,10.8 23.41,9.8 TP6.1 ; 22.07,11.78 U4.3 21.51,11.78 C12.2
  Top Layer w0.3: R12.1 20.77,12.52 C12.2
$2N18: length 4.4
  Top Layer w0.2: U4.1 22.25,12.78 C34.1
  Top Layer w0.3: R9.1 23.48,15.15 R17.2 23.54,14.08 C34.1
$2N40: length 1.3
  Top Layer w0.2: R20.1 10.32,7.94 LED2.2

## Copper pours and planes (outline as drawn; the poured copper is in the pictures)
GND on Top Layer: -6.32,28.15 105.47,28.15 105.47,-4.59 -6.32,-4.59
GND on Bottom Layer: -3.93,29.53 103.12,29.53 103.12,-7.85 -3.93,-7.85
GND on GND: 0.26,22.74 98.74,22.74 98.74,0.26 0.26,0.26
VDDIO on VDDIO: 0.26,22.74 98.74,22.74 98.74,0.26 0.26,0.26

Small or netless copper shapes (teardrops, artwork), in the pictures only: 6 on VDDIO, 17 on GND

## Text on the board
Top Silkscreen Layer: 5V | D- | GND | D+ | 1V8 | 3V3 | 20260821-V02 | XU316 | AUDIO BEAMFORMING
